# EAGLE schematic RPi Zero W Breakout (EAGLE 9.2.2)
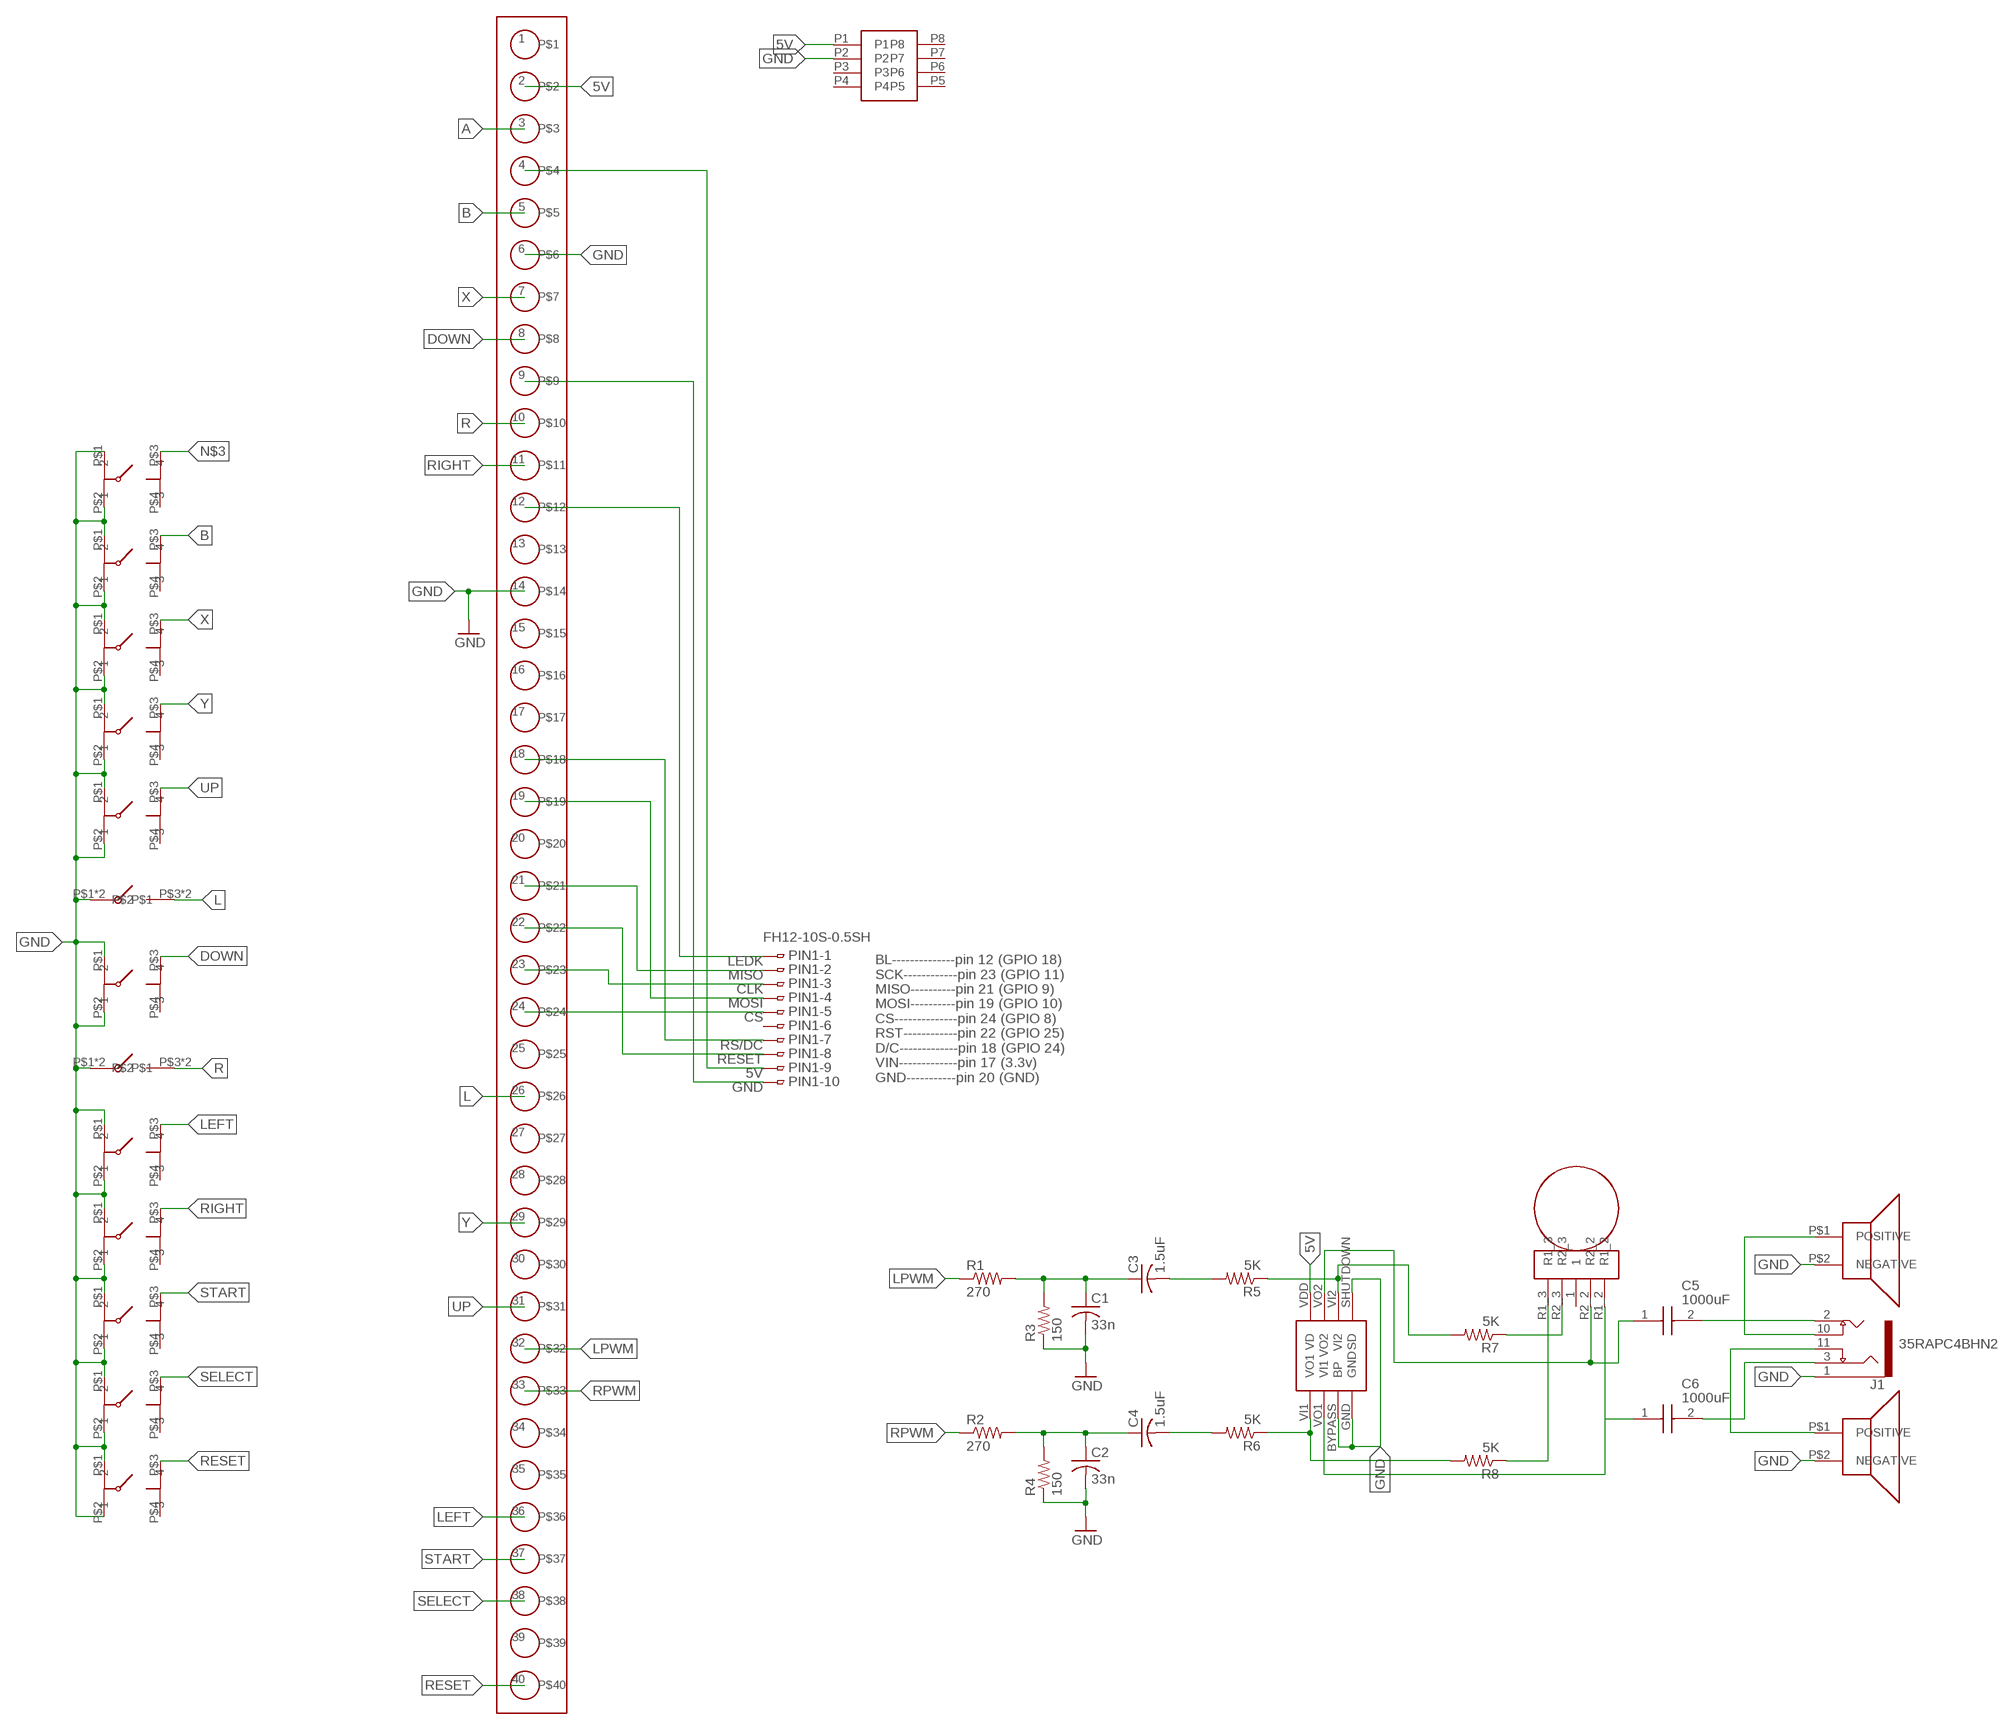
[diagram p0: schematic, sheet 1]

## Parts
A  SWITCHTACTILESPST-NO0.05A24V  [1825910]
B  SWITCHTACTILESPST-NO0.05A24V  [1825910]
C1  33n  C-USC0805K  [C0805K]
C2  33n  C-USC0805K  [C0805K]
C3  1.5uF  C-USC0805K  [C0805K]
C4  1.5uF  C-USC0805K  [C0805K]
C5  1000uF  UWT0J102MNL1GS  [UWT(8X10)]
C6  1000uF  UWT0J102MNL1GS  [UWT(8X10)]
DOWN  SWITCHTACTILESPST-NO0.05A24V  [1825910]
J1  35RAPC4BHN2  [SWITCHCRAFT_35RAPC4BHN2]
L  SWITCHTACTILESPST-NO0.05A24V  [1825027-6]
LEFT  SWITCHTACTILESPST-NO0.05A24V  [1825910]
LSPK  SP-1208  [SP-1208]
PIN1  FH12-10S-0.5SH  [FH12-10S-0.5SH]
R  SWITCHTACTILESPST-NO0.05A24V  [1825027-6]
R1  270  R-US_R0805  [R0805]
R2  270  R-US_R0805  [R0805]
R3  150  R-US_R0805  [R0805]
R4  150  R-US_R0805  [R0805]
R5  5K  R-US_R0805  [R0805]
R6  5K  R-US_R0805  [R0805]
R7  5K  R-US_R0805  [R0805]
R8  5K  R-US_R0805  [R0805]
RESET  SWITCHTACTILESPST-NO0.05A24V  [1825910]
RIGHT  SWITCHTACTILESPST-NO0.05A24V  [1825910]
RSPK  SP-1208  [SP-1208]
SELECT  SWITCHTACTILESPST-NO0.05A24V  [1825910]
START  SWITCHTACTILESPST-NO0.05A24V  [1825910]
U$1  20X20.1HEADERS  [20X20.1"MALEHEADERS]
U$2  LM4810MM/NOPBCT-ND  [NOPBCT-ND]
U$3  M22-6340442  [M22-6340442]
U$4  RK14J12A0A0K  [RK14J12A0A0K]
UP  SWITCHTACTILESPST-NO0.05A24V  [1825910]
X  SWITCHTACTILESPST-NO0.05A24V  [1825910]
Y  SWITCHTACTILESPST-NO0.05A24V  [1825910]

## Nets
5V: PIN1.9 U$1.2 U$1.4 U$2.VDD(VD) U$3.P1
A: U$1.3
B: B.P$3 U$1.5
CLK: PIN1.3 U$1.23
CS: PIN1.5 U$1.24
DOWN: DOWN.P$3 U$1.8
GND: A.P$1 A.P$2 B.P$1 B.P$2 C1.2 C2.2 DOWN.P$1 DOWN.P$2 J1.1 L.P$1 L.P$2 LEFT.P$1 LEFT.P$2 LSPK.P$2(NEGATIVE) PIN1.10 R3.1 R4.1 R.P$1 R.P$2 RESET.P$1 RESET.P$2 RIGHT.P$1 RIGHT.P$2 RSPK.P$2(NEGATIVE) SELECT.P$1 SELECT.P$2 START.P$1 START.P$2 U$1.6 U$1.9 U$1.14 U$2.BYPASS(BP) U$2.GND U$2.SHUTDOWN(SD) U$3.P2 UP.P$1 UP.P$2 X.P$1 X.P$2 Y.P$1 Y.P$2
L: L.P$3 L.P$4 U$1.26
LEDK: PIN1.1 U$1.12
LEFT: LEFT.P$3 U$1.36
LPWM: R1.1 U$1.32
MISO: PIN1.2 U$1.21
MOSI: PIN1.4 U$1.19
N$1: C1.1 C3.1 R1.2 R3.2
N$2: C2.1 C4.1 R2.2 R4.2
N$3: A.P$3
N$4: C3.2 R5.2
N$5: R7.1 U$4.R2_3
N$6: C4.2 R6.2
N$7: R8.1 U$4.R1_3
N$8: C6.1(+) U$2.VO1(VI1) U$4.R1_2
N$9: C5.1(+) U$2.VO2 U$4.R2_2
N$10: C5.2(-) J1.2
N$11: C6.2(-) J1.3
N$12: J1.10 RSPK.P$1(POSITIVE)
N$13: J1.11 LSPK.P$1(POSITIVE)
N$14: R5.1 R7.2 U$2.VI2
N$15: R6.1 R8.2 U$2.VI1(VO1)
R: R.P$3 R.P$4 U$1.10
RESET: PIN1.8 RESET.P$3 U$1.22 U$1.40
RIGHT: RIGHT.P$3 U$1.11
RPWM: R2.1 U$1.33
RS/DC: PIN1.7 U$1.18
SELECT: SELECT.P$3 U$1.38
START: START.P$3 U$1.37
UP: U$1.31 UP.P$3
X: U$1.7 X.P$3
Y: U$1.29 Y.P$3
Unconnected: A.P$4 B.P$4 DOWN.P$4 LEFT.P$4 PIN1.6 RESET.P$4 RIGHT.P$4 SELECT.P$4 START.P$4 U$1.1 U$1.13 U$1.15 U$1.16 U$1.17 U$1.20 U$1.25 U$1.27 U$1.28 U$1.30 U$1.34 U$1.35 U$1.39 U$3.P3 U$3.P4 U$3.P5 U$3.P6 U$3.P7 U$3.P8 U$4.1 UP.P$4 X.P$4 Y.P$4

## Notes on the sheet
- BL--------------pin 12 (GPIO 18)
  SCK------------pin 23 (GPIO 11)
  MISO----------pin 21 (GPIO 9)
  MOSI----------pin 19 (GPIO 10)
  CS--------------pin 24 (GPIO 8)
  RST------------pin 22 (GPIO 25)
  D/C-------------pin 18 (GPIO 24)
  VIN-------------pin 17 (3.3v)
  GND-----------pin 20 (GND)

## Library data of the parts
A B DOWN LEFT RESET RIGHT SELECT START UP X Y = SWITCH TACTILE SPST-NO 0.05A 24V:SWITCHTACTILESPST-NO0.05A24V: SWITCH TACTILE SPST-NO 0.05A 24V
C1-C4 = rcl:C-US: CAPACITOR, American symbol; SPICEPREFIX: C
C5 C6 = SamacSys_Parts:UWT0J102MNL1GS: Nichicon 1000uF +/-20% 6.3 V 5101-4 SMD Metal Can Aluminium Electrolytic Capacitor Source: Datasheet <https://componentsearchengine.com/Datasheets/1/UWT0J102MNL1GS.pdf>; DESCRIPTION: Nichicon 1000uF +/-20% 6.3 V 5101-4 SMD Metal Can Aluminium Electrolytic Capacitor; HEIGHT: mm; MANUFACTURER_NAME: Nichicon; MANUFACTURER_PART_NUMBER: UWT0J102MNL1GS; MOUSER_PART_NUMBER: 647-UWT0J102MNL1S
J1 = 35RAPC4BHN2:35RAPC4BHN2: Conn 3.5MM Stereo Jack F 5 POS Solder RA Thru-Hole 5 Terminal 1 Port; DESCRIPTION: Conn 3.5MM Stereo Jack F 5 POS Solder RA Thru-Hole 5 Terminal 1 Port; DIGI-KEY_PART_NUMBER: SC1459-ND; DIGI-KEY_PURCHASE_URL: https://www.digikey.com/product-detail/en/switchcraft-inc/35RAPC4BHN2/SC1459-ND/1288690?utm_source=snapeda&utm_medium=aggregator&utm_campaign=symbol; MF: Switchcraft; MP: 35RAPC4BHN2; PACKAGE: None
L R = 1825027-6:SWITCHTACTILESPST-NO0.05A24V: Tactile Switch SPST-NO Side Actuated Through Hole, Right Angle
LSPK RSPK = SP-1208:SP-1208: SPEAKER 8OHM 250MW TOP PORT 63DB
PIN1 = con-hirose:FH12-10S-0.5S: 0.5mm Pitch Connectors For FPC/FFC Source: Data sheet <http://www.hirose.co.jp/cataloge_hp/e58605370.pdf>; MPN: FH12-10S-0.5SH(55); OC_FARNELL: 1324540; OC_NEWARK: 34M6152
R1-R8 = rcl:R-US_: RESISTOR, American symbol; SPICEPREFIX: R
U$1 = 20x20.1:20X20.1HEADERS: 20x2 0.1' pitch Male Pins for RPi Zero
U$2 = LM4810MM:LM4810MM/NOPBCT-ND: Dual 105mW Headphone Amplifier with Active-High Shutdown Mode
U$3 = M22-6340442:M22-6340442: 8 Pin Header 2.0mm pitch
U$4 = RK14J12A0A0K:RK14J12A0A0K: Potentiometers Dual Unit 14mm 3B insertion (2mm)